# EAGLE schematic Alight_main_board_v3 (EAGLE 7.6.0)
CNAME: Alarm Light Main board / Juraj Repcik; CREVISION: 04
Assembly variants: ESP8266 CH340 default

## Sheet 1 of 3
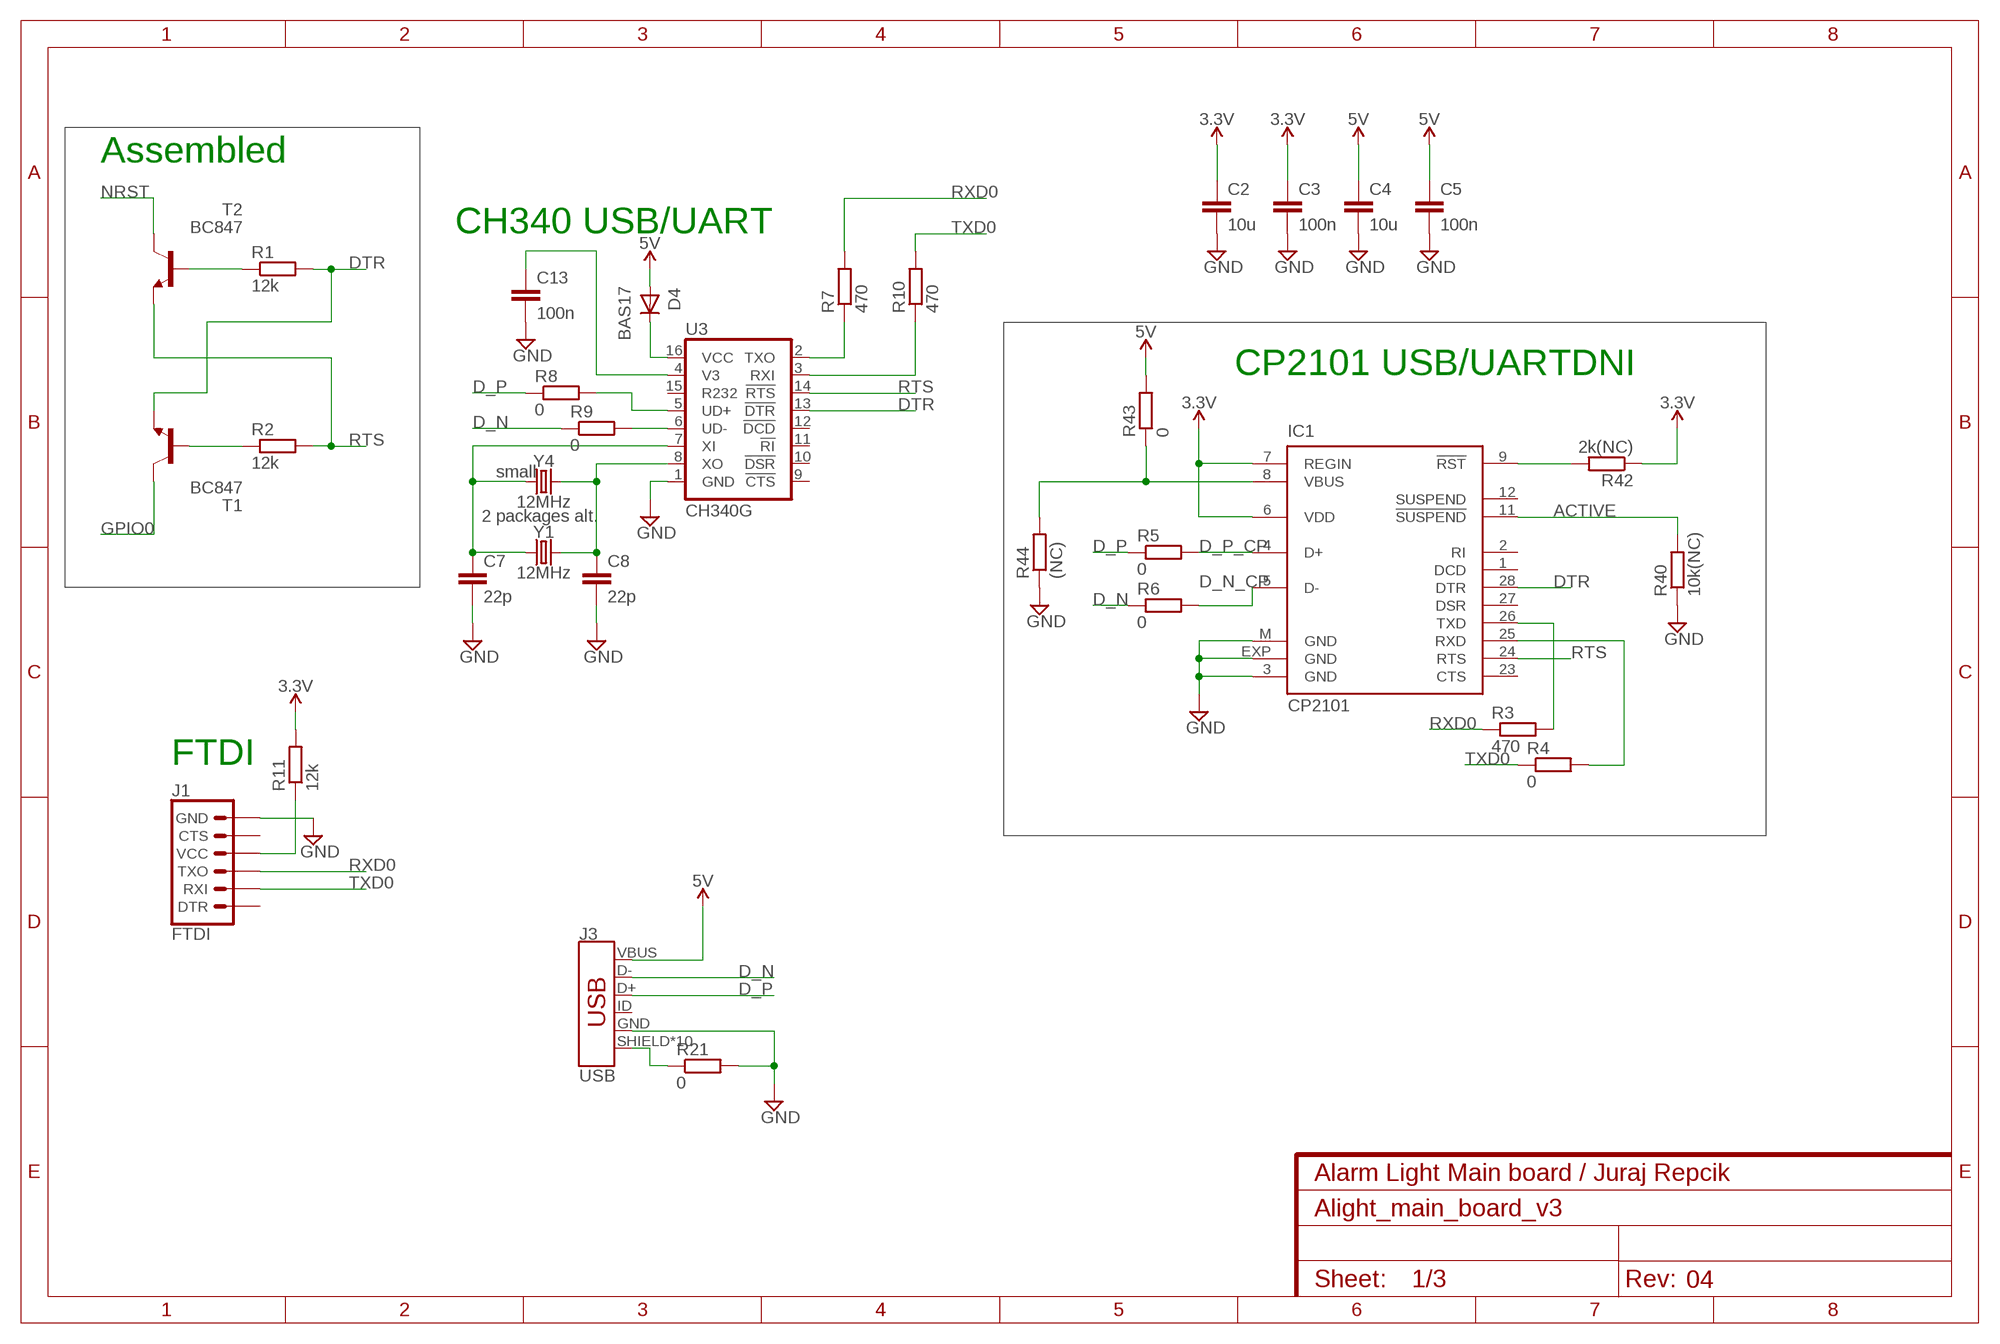
[diagram p0: schematic, sheet 1]

### Parts
C2  10u  C-EUC0603K  [C0603K]
C3  100n  C-EUC0603K  [C0603K]
C4  10u  C-EUC0603K  [C0603K]
C5  100n  C-EUC0603K  [C0603K]
C7  22p  C-EUC0402  [C0402]
C8  22p  C-EUC0402  [C0402]
C13  100n  C-EUC0603K  [C0603K]
D4  BAS17  [SOT23]
IC1  CP2101  CP210X_USB_UART  [MLP28]  (not fitted in variant ESP8266 CH340 default)
J1  FTDI  6_PIN_SERIAL_TARGETLONGPADS  [1X06_LONGPADS]
J3  USB  USB_MICRO-B_HALF_PTH_MILL  [USB-MICROB-PTH-MILL]
R1  12k  R-EU_R0603  [R0603]
R2  12k  R-EU_R0603  [R0603]
R3  470  R-EU_R0603  [R0603]  (not fitted in variant ESP8266 CH340 default)
R4  0  R-EU_R0603  [R0603]  (not fitted in variant ESP8266 CH340 default)
R5  0  R-EU_R0603  [R0603]  (not fitted in variant ESP8266 CH340 default)
R6  0  R-EU_R0603  [R0603]  (not fitted in variant ESP8266 CH340 default)
R7  470  R-EU_R0603  [R0603]
R8  0  R-EU_R0603  [R0603]
R9  0  R-EU_R0603  [R0603]
R10  470  R-EU_R0603  [R0603]
R11  12k  R-EU_R0603  [R0603]
R21  0  R-EU_R0603  [R0603]
R40  10k(NC)  R-EU_R0603  [R0603]  (not fitted in variant ESP8266 CH340 default)
R42  2k(NC)  R-EU_R0603  [R0603]  (not fitted in variant ESP8266 CH340 default)
R43  0  R-EU_R0603  [R0603]  (not fitted in variant ESP8266 CH340 default)
R44  (NC)  R-EU_R0603  [R0603]  (not fitted in variant ESP8266 CH340 default)
T1  BC847  [SOT23]
T2  BC847  [SOT23]
U3  CH340G  CH340GSMD  [SO016]
Y1  12MHz  CRYSTALSMD-HC49UP  [HC49UP]
Y4  12MHz  CRYSTAL-32.768KHZSMD-3.2X1.5  [CRYSTAL-SMD-3.2X1.5MM]  (not fitted in variant ESP8266 CH340 default)

### Nets
3.3V: C2.1 C3.1 IC1.6(VDD) IC1.7(REGIN) R11.2 R42.1 ; also sheet 2,3
5V: C4.1 C5.1 D4.1(A) J3.VBUS R43.2 ; also sheet 2,3
ACTIVE: IC1.11(!SUSPEND) R40.2
D_N: J3.D- R6.1 R9.1
D_N_CP: IC1.5(D-) R6.2
D_P: J3.D+ R5.1 R8.1
D_P_CP: IC1.4(D+) R5.2
DTR: IC1.28(DTR) R1.2 T1.2(E) U3.13(!DTR)
GND: C2.2 C3.2 C4.2 C5.2 C7.2 C8.2 C13.2 IC1.3(GND) IC1.EXP(GND) IC1.M(GND) J1.6(GND) J3.GND R21.2 R40.1 R44.1 U3.1(GND) ; also sheet 2,3
GPIO0: T1.3(C) ; also sheet 2
N$1: R1.1 T2.1(B)
N$2: R2.1 T1.1(B)
N$4: R7.1 U3.2(TXO)
N$5: R10.1 U3.3(RXI)
N$6: R8.2 U3.5(UD+)
N$7: R9.2 U3.6(UD-)
N$8: C7.1 U3.7(XI) Y1.1 Y4.P$1
N$9: C13.1 U3.4(V3)
N$10: C8.1 U3.8(XO) Y1.2 Y4.P$2
N$11: J1.4(VCC) R11.1
N$15: D4.3(K) U3.16(VCC)
N$38: IC1.9(!RST) R42.2
N$39: IC1.8(VBUS) R43.1 R44.2
NRST: T2.3(C) ; also sheet 2,3
RTS: IC1.24(RTS) R2.2 T2.2(E) U3.14(!RTS)
RXD0: J1.3(TXO) R3.1 R7.2 ; also sheet 2,3
RXD0_CP2101IN: IC1.26(TXD) R3.2
SHIELD: J3.SHIELD J3.SHIELD2(SHIELD) J3.SHIELD3(SHIELD) J3.SHIELD4(SHIELD) J3.SHIELD5(SHIELD) J3.SHIELD6(SHIELD) J3.SHIELD7(SHIELD) J3.SHIELD8(SHIELD) J3.SHIELD9(SHIELD) J3.SHIELD10(SHIELD) R21.1
TXD0: J1.2(RXI) R4.1 R10.2 ; also sheet 2,3
TXD0_CP2101: IC1.25(RXD) R4.2
Unconnected: IC1.1(DCD) IC1.2(RI) IC1.12(SUSPEND) IC1.23(CTS) IC1.27(DSR) J1.1(DTR) J1.5(CTS) J3.ID U3.9(!CTS) U3.10(!DSR) U3.11(!RI) U3.12(!DCD) U3.15(R232)

### Notes on the sheet
- Assembled
- CH340 USB/UART
- CP2101 USB/UART | DNI
- small
- 2 packages alt.
- FTDI

## Sheet 2 of 3
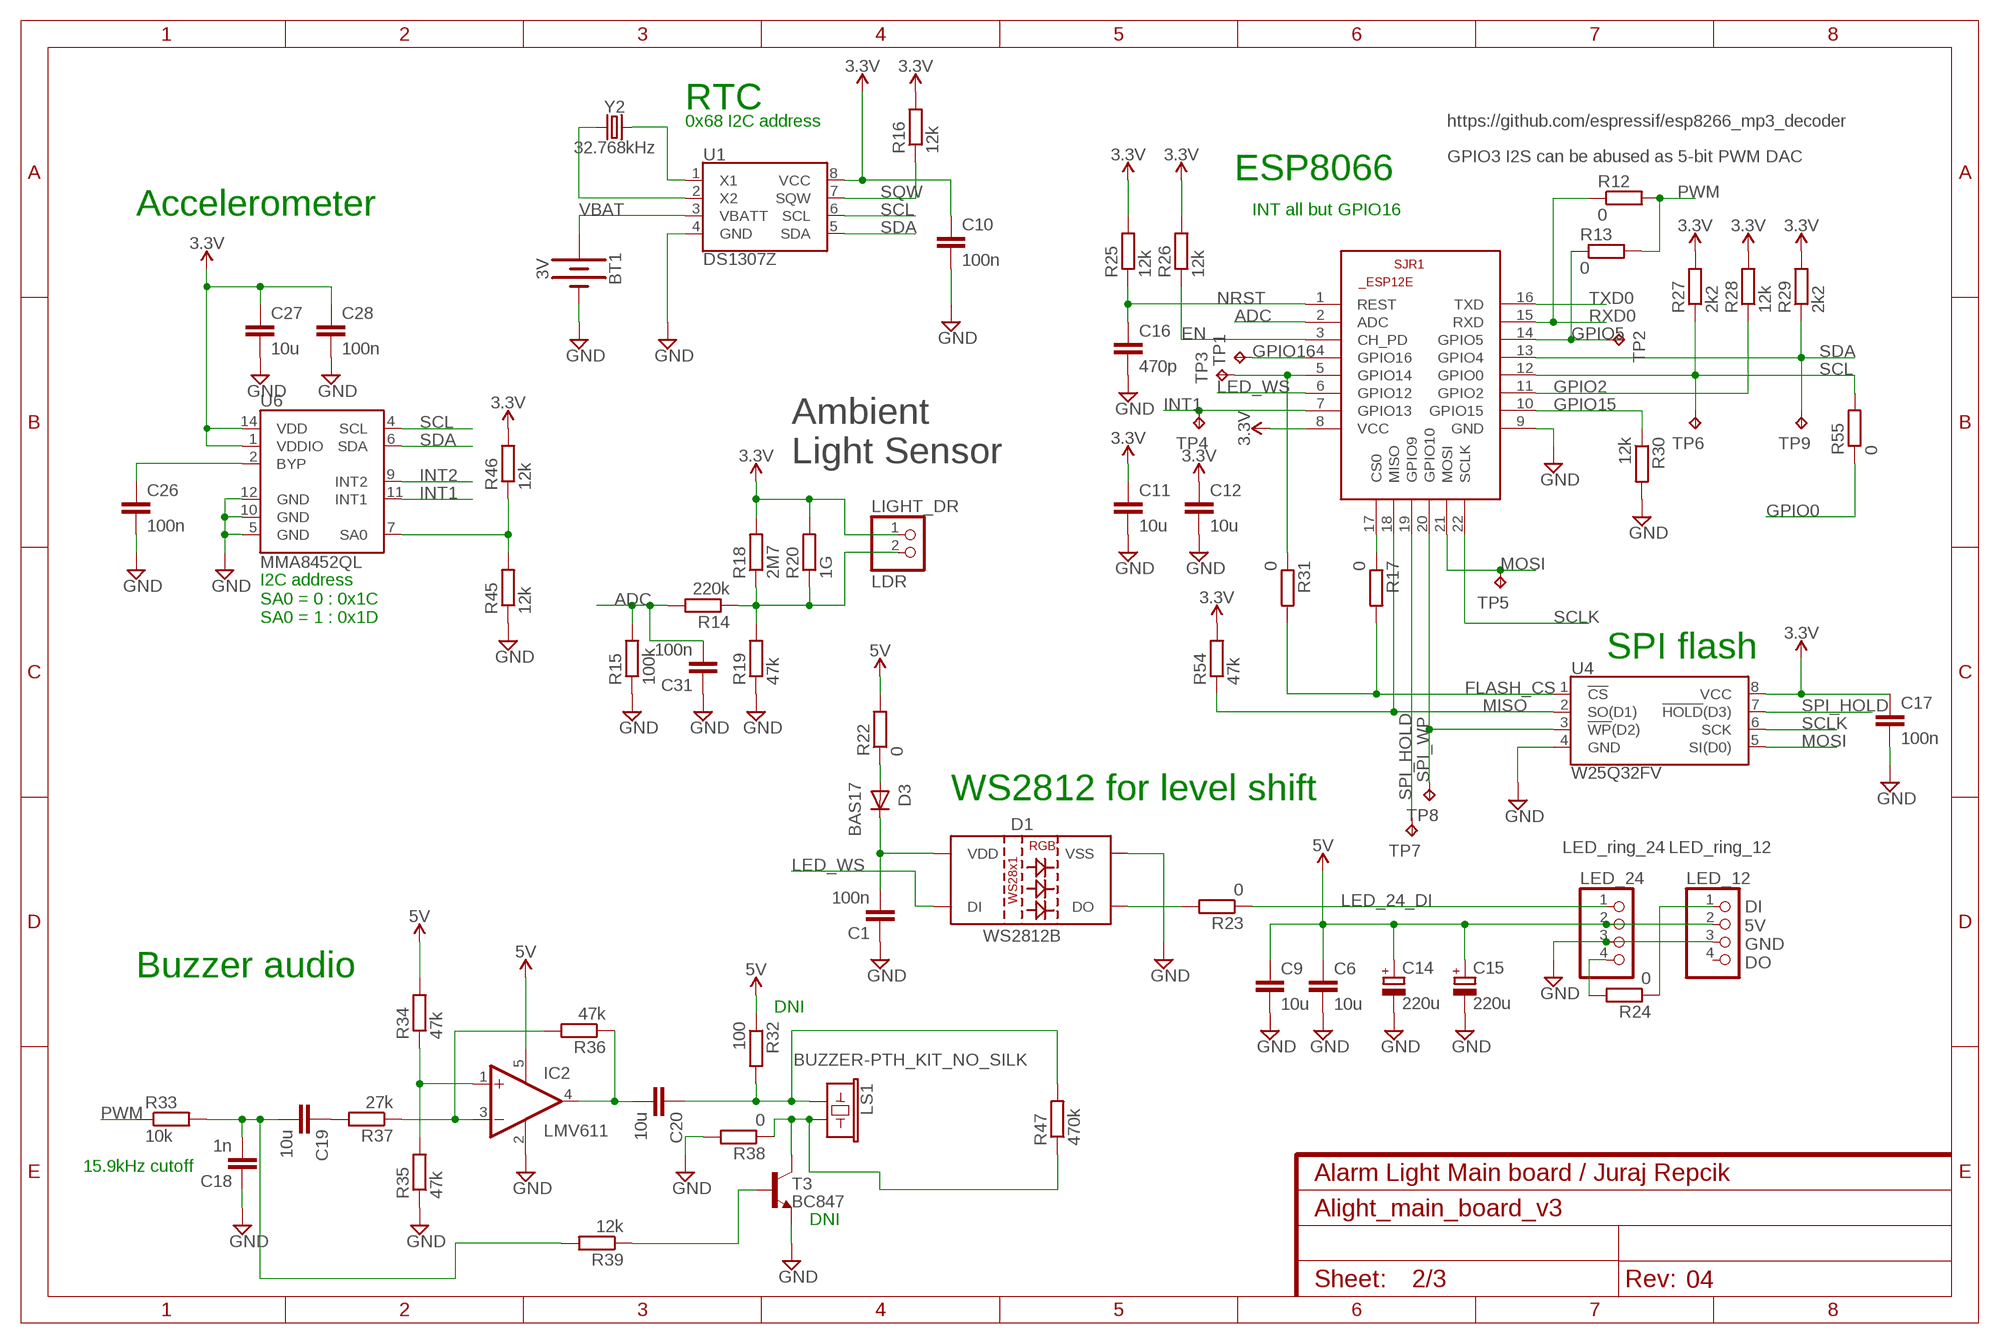
[diagram p1: schematic, sheet 2]

### Parts
BT1  3V  BATTERY-20MM_PTH_KIT  [BATTCOM_20MM_PTH_KIT]
C1  100n  C-EUC0603K  [C0603K]
C6  10u  C-EUC0603K  [C0603K]
C9  10u  C-EUC0603K  [C0603K]
C10  100n  C-EUC0603K  [C0603K]
C11  10u  C-EUC0603K  [C0603K]
C12  10u  C-EUC0603K  [C0603K]
C14  220u  CPOL-EU153CLV-0605  [153CLV-0605]
C15  220u  CPOL-EU153CLV-0605  [153CLV-0605]
C16  470p  C-EUC0603K  [C0603K]
C17  100n  C-EUC0603K  [C0603K]  (not fitted in variant ESP8266 CH340 default)
C18  1n  C-EUC0603K  [C0603K]
C19  10u  C-EUC0603K  [C0603K]
C20  10u  C-EUC0603K  [C0603K]
C26  100n  C-EUC0603K  [C0603K]
C27  10u  C-EUC0603K  [C0603K]
C28  100n  C-EUC0603K  [C0603K]
C31  100n  C-EUC0603K  [C0603K]
D1  WS2812B  [WS2812B]
D3  BAS17  [SOT23]
IC2  LMV611  OPA333DCK  [SC70-5L]
LED_12  LED_ring_12  PINHD-1X4  [1X04]
LED_24  LED_ring_24  PINHD-1X4  [1X04]
LIGHT_DR  LDR  PINHD-1X2  [1X02]
LS1  BUZZER-PTH_KIT_NO_SILK  [BUZZER-12MM-NS-KIT]
R12  0  R-EU_R0603  [R0603]
R13  0  R-EU_R0603  [R0603]  (not fitted in variant ESP8266 CH340 default)
R14  220k  R-EU_R0603  [R0603]
R15  100k  R-EU_R0603  [R0603]
R16  12k  R-EU_R0603  [R0603]
R17  0  R-EU_R0603  [R0603]  (not fitted in variant ESP8266 CH340 default)
R18  2M7  R-EU_R0603  [R0603]
R19  47k  R-EU_R0603  [R0603]
R20  1G  R-EU_R0603  [R0603]  (not fitted in variant ESP8266 CH340 default)
R22  0  R-EU_R0603  [R0603]
R23  0  R-EU_R0603  [R0603]
R24  0  R-EU_R0603  [R0603]
R25  12k  R-EU_R0603  [R0603]
R26  12k  R-EU_R0603  [R0603]
R27  2k2  R-EU_R0603  [R0603]
R28  12k  R-EU_R0603  [R0603]
R29  2k2  R-EU_R0603  [R0603]
R30  12k  R-EU_R0603  [R0603]
R31  0  R-EU_R0603  [R0603]  (not fitted in variant ESP8266 CH340 default)
R32  100  R-EU_R0603  [R0603]  (not fitted in variant ESP8266 CH340 default)
R33  10k  R-EU_R0603  [R0603]
R34  47k  R-EU_R0603  [R0603]
R35  47k  R-EU_R0603  [R0603]
R36  47k  R-EU_R0603  [R0603]
R37  27k  R-EU_R0603  [R0603]
R38  0  R-EU_R0603  [R0603]
R39  12k  R-EU_R0603  [R0603]  (not fitted in variant ESP8266 CH340 default)
R45  12k  R-EU_R0603  [R0603]  (not fitted in variant ESP8266 CH340 default)
R46  12k  R-EU_R0603  [R0603]
R47  470k  R-EU_R0603  [R0603]
R54  47k  R-EU_R0603  [R0603]  (not fitted in variant ESP8266 CH340 default)
R55  0  R-EU_R0603  [R0603]
SJR1  ESP12E/F  ESP8266-12EESP12E  [ESP8266-ESP12E]
T3  BC847  [SOT23]  (not fitted in variant ESP8266 CH340 default)
TP1  TPTP10R  [TP10R]
TP2  TPTP10R  [TP10R]
TP3  TPTP10R  [TP10R]
TP4  TPTP10R  [TP10R]
TP5  TPTP10R  [TP10R]
TP6  TPTP10R  [TP10R]
TP7  TPTP10R  [TP10R]
TP8  TPTP10R  [TP10R]
TP9  TPTP10R  [TP10R]
U1  DS1307Z  [SO08-0.15]
U4  W25Q32FV  W25Q32FVSS  [SOIC-8]  (not fitted in variant ESP8266 CH340 default)
U6  MMA8452QL  [QFN-16_0.5MM-EXTRA]
Y2  32.768kHz  CRYSTAL-32.768KHZSMD-3.2X1.5  [CRYSTAL-SMD-3.2X1.5MM]

### Nets
3.3V: C10.1 C11.1 C12.1 C17.1 C27.1 C28.1 LIGHT_DR.1 R16.2 R18.2 R20.2 R25.2 R26.2 R27.2 R28.2 R29.2 R46.2 R54.2 SJR1.8(VCC) U1.8(VCC) U4.8(VCC) U6.1(VDDIO) U6.14(VDD) ; also sheet 1,3
5V: C6.1 C9.1 C14.+ C15.+ IC2.5(V+) LED_12.2 LED_24.2 R22.2 R32.1 R34.2 ; also sheet 1,3
ADC: C31.2 R14.2 R15.2 SJR1.2(ADC) ; also sheet 3
EN: R26.1 SJR1.3(CH_PD)
FLASH_CS: R17.2 R31.2 U4.1(!CS!) ; also sheet 3
GND: BT1.2(-) C1.1 C6.2 C9.2 C10.2 C11.2 C12.2 C14.- C15.- C16.2 C17.2 C18.1 C26.2 C27.2 C28.2 C31.1 D1.3(VSS) IC2.2(V-) LED_12.3 LED_24.3 R15.1 R19.1 R30.2 R35.1 R38.2 R45.1 SJR1.9(GND) T3.2(E) U1.4(GND) U4.4(GND) U6.5(GND) U6.10(GND) U6.12(GND) ; also sheet 1,3
GPIO0: R55.1 ; also sheet 1
GPIO2: R28.1 SJR1.11(GPIO2) ; also sheet 3
GPIO5: R13.1 SJR1.14(GPIO5) TP2.TP
GPIO15: R30.1 SJR1.10(GPIO15)
GPIO16: SJR1.4(GPIO16) TP1.TP
INT1: SJR1.7(GPIO13) TP4.TP U6.11(INT1) ; also sheet 3
INT2: U6.9(INT2) ; also sheet 3
LED_12DI: LED_12.1 R24.1
LED_24_DI: LED_24.1 R23.1
LED_24_DO: LED_24.4 R24.2
LED_WS: D1.4(DI) SJR1.6(GPIO12) ; also sheet 3
MISO: R54.1 SJR1.18(MISO) U4.2(SO(D1))
MOSI: SJR1.21(MOSI) TP5.TP U4.5(SI(D0))
N$3: C1.2 D1.1(VDD) D3.3(K)
N$14: LIGHT_DR.2 R14.1 R18.1 R19.2 R20.1
N$16: D3.1(A) R22.1
N$18: D1.2(DO) R23.2
N$19: C26.1 U6.2(BYP)
N$21: R31.1 SJR1.5(GPIO14) TP3.TP
N$22: R17.1 SJR1.17(CS0)
N$25: LS1.- R38.1 R47.1 T3.3(C)
N$26: R39.1 T3.1(B)
N$28: IC2.1(+IN) R34.1 R35.2
N$30: U1.1(X1) Y2.P$2
N$31: U1.2(X2) Y2.P$1
N$32: IC2.3(-IN) R36.2 R37.1
N$33: C20.1 LS1.+ R32.2 R47.2
N$34: C19.1 R37.2
N$35: C20.2 IC2.4(OUT) R36.1
N$36: C18.2 C19.2 R33.2 R39.2
N$40: R45.2 R46.1 U6.7(SA0)
NRST: C16.1 R25.1 SJR1.1(REST) ; also sheet 1,3
PWM: R12.2 R13.2 R33.1 ; also sheet 3
RXD0: R12.1 SJR1.15(RXD) ; also sheet 1,3
SCL: R27.1 R55.2 SJR1.12(GPIO0) TP6.TP U1.6(SCL) U6.4(SCL) ; also sheet 3
SCLK: SJR1.22(SCLK) U4.6(SCK)
SDA: R29.1 SJR1.13(GPIO4) TP9.TP U1.5(SDA) U6.6(SDA) ; also sheet 3
SPI_HOLD: SJR1.19(GPIO9) TP7.TP U4.7(!HOLD!(D3))
SPI_WP: SJR1.20(GPIO10) TP8.TP U4.3(!WP!(D2))
SQW: R16.1 U1.7(SQW)
TXD0: SJR1.16(TXD) ; also sheet 1,3
VBAT: BT1.1(+) U1.3(VBATT)
Unconnected: LED_12.4

### Notes on the sheet
- RTC
- 0x68 I2C address | https://github.com/espressif/esp8266_mp3_decoder
- GPIO3 I2S can be abused as 5-bit PWM DAC
- ESP8066
- Accelerometer | INT all but GPIO16
- Ambient
  Light Sensor
- I2C address
  SA0 = 0 : 0x1C
  SA0 = 1 : 0x1D
- SPI flash
- WS2812 for level shift
- DI
  5V
  GND
  DO
- Buzzer audio
- DNI
- 15.9kHz cutoff
- DNI

## Sheet 3 of 3
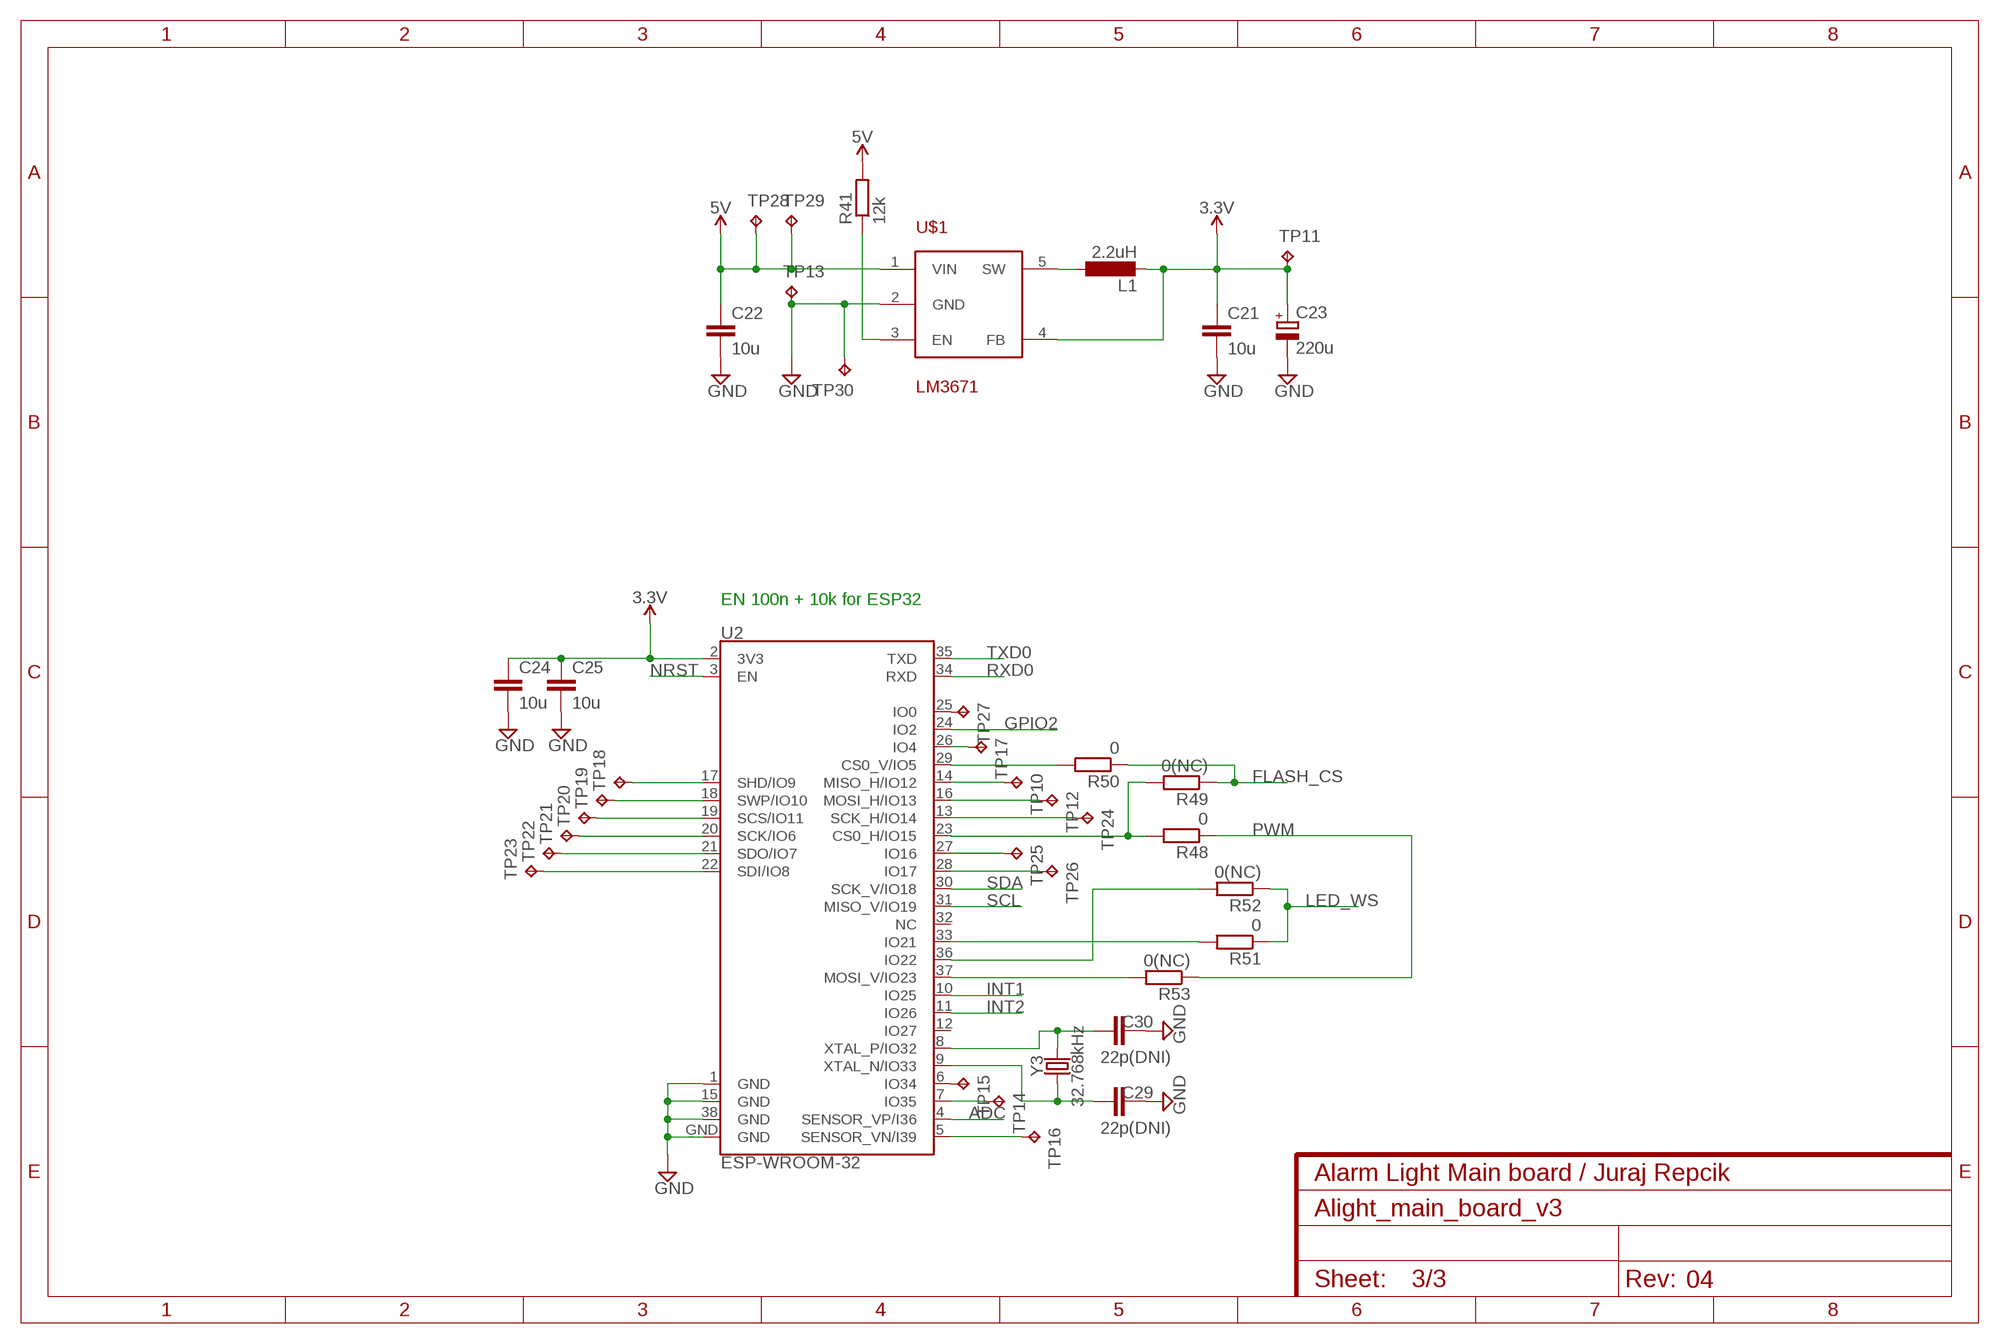
[diagram p2: schematic, sheet 3]

### Parts
C21  10u  C-EUC0603K  [C0603K]
C22  10u  C-EUC0603K  [C0603K]
C23  220u  CPOL-EU153CLV-0605  [153CLV-0605]
C24  10u  C-EUC0603K  [C0603K]  (not fitted in variant ESP8266 CH340 default)
C25  10u  C-EUC0603K  [C0603K]  (not fitted in variant ESP8266 CH340 default)
C29  22p(DNI)  C-EUC0402  [C0402]  (not fitted in variant ESP8266 CH340 default)
C30  22p(DNI)  C-EUC0402  [C0402]  (not fitted in variant ESP8266 CH340 default)
L1  2.2uH  L-EUL3225M  [L3225M]
R41  12k  R-EU_R0603  [R0603]
R48  0  R-EU_R0603  [R0603]  (not fitted in variant ESP8266 CH340 default)
R49  0(NC)  R-EU_R0603  [R0603]  (not fitted in variant ESP8266 CH340 default)
R50  0  R-EU_R0603  [R0603]  (not fitted in variant ESP8266 CH340 default)
R51  0  R-EU_R0603  [R0603]  (not fitted in variant ESP8266 CH340 default)
R52  0(NC)  R-EU_R0603  [R0603]  (not fitted in variant ESP8266 CH340 default)
R53  0(NC)  R-EU_R0603  [R0603]  (not fitted in variant ESP8266 CH340 default)
TP10  TPTP10R  [TP10R]
TP11  TPTP10R  [TP10R]
TP12  TPTP10R  [TP10R]
TP13  TPTP10R  [TP10R]
TP14  TPTP10R  [TP10R]
TP15  TPTP10R  [TP10R]
TP16  TPTP10R  [TP10R]
TP17  TPTP10R  [TP10R]
TP18  TPTP10R  [TP10R]
TP19  TPTP10R  [TP10R]
TP20  TPTP10R  [TP10R]
TP21  TPTP10R  [TP10R]
TP22  TPTP10R  [TP10R]
TP23  TPTP10R  [TP10R]
TP24  TPTP10R  [TP10R]
TP25  TPTP10R  [TP10R]
TP26  TPTP10R  [TP10R]
TP27  TPTP10R  [TP10R]
TP28  TPTP10R  [TP10R]
TP29  TPTP10R  [TP10R]
TP30  TPTP10R  [TP10R]
U2  ESP-WROOM-32  [ESP-WROOM-32]  (not fitted in variant ESP8266 CH340 default)
U$1  LM3671  [SOT23-5]
Y3  32.768kHz  CRYSTAL-32.768KHZSMD-3.2X1.5  [CRYSTAL-SMD-3.2X1.5MM]  (not fitted in variant ESP8266 CH340 default)

### Nets
3.3V: C21.1 C23.+ C24.1 C25.1 L1.2 TP11.TP U2.2(3V3) U$1.4(FB) ; also sheet 1,2
5V: C22.1 R41.2 TP28.TP TP29.TP U$1.1(VIN) ; also sheet 1,2
ADC: U2.4(SENSOR_VP/I36) ; also sheet 2
FLASH_CS: R49.1 R50.1 ; also sheet 2
GND: C21.2 C22.2 C23.- C24.2 C25.2 C29.2 C30.2 TP13.TP TP30.TP U2.1(GND) U2.15(GND) U2.38(GND) U2.GND U$1.2(GND) ; also sheet 1,2
GPIO2: U2.24(IO2) ; also sheet 2
INT1: U2.10(IO25) ; also sheet 2
INT2: U2.11(IO26) ; also sheet 2
LED_WS: R51.1 R52.1 ; also sheet 2
N$12: C30.1 U2.8(XTAL_P/IO32) Y3.P$2
N$13: C29.1 U2.9(XTAL_N/IO33) Y3.P$1
N$20: R48.2 R49.2 U2.23(CS0_H/IO15)
N$23: R51.2 U2.33(IO21)
N$24: R52.2 U2.36(IO22)
N$27: R41.1 U$1.3(EN)
N$37: L1.1 U$1.5(SW)
N$41: R50.2 U2.29(CS0_V/IO5)
N$42: R53.2 U2.37(MOSI_V/IO23)
N$43: TP14.TP U2.7(IO35)
N$44: TP15.TP U2.6(IO34)
N$45: TP16.TP U2.5(SENSOR_VN/I39)
N$46: TP17.TP U2.26(IO4)
N$47: TP18.TP U2.17(SHD/IO9)
N$48: TP19.TP U2.18(SWP/IO10)
N$49: TP20.TP U2.19(SCS/IO11)
N$50: TP21.TP U2.20(SCK/IO6)
N$51: TP22.TP U2.21(SDO/IO7)
N$52: TP23.TP U2.22(SDI/IO8)
N$63: TP10.TP U2.14(MISO_H/IO12)
N$64: TP12.TP U2.16(MOSI_H/IO13)
N$65: TP24.TP U2.13(SCK_H/IO14)
N$66: TP25.TP U2.27(IO16)
N$67: TP26.TP U2.28(IO17)
N$68: TP27.TP U2.25(IO0)
NRST: U2.3(EN) ; also sheet 1,2
PWM: R48.1 R53.1 ; also sheet 2
RXD0: U2.34(RXD) ; also sheet 1,2
SCL: U2.31(MISO_V/IO19) ; also sheet 2
SDA: U2.30(SCK_V/IO18) ; also sheet 2
TXD0: U2.35(TXD) ; also sheet 1,2
Unconnected: U2.12(IO27) U2.32(NC)

### Notes on the sheet
- EN 100n + 10k for ESP32

## Library data of the parts
BT1 = SparkFun-Batteries:BATTERY: Battery - Single Cell A variety of battery chemistries, sizes, and footprints. Device List: 20MM_PTH - Coin Cell Battery Holder - 20mm (PTH) <https://www.sparkfun.com/products/783> 20MM_PTH_KIT- Coin Cell battery Holder - 20 mm (PTH) <http://www.sparkfun.com/products/783>kit version with special mask 6.8MM_PTH - Coin Cell Battery Holder - 6.8MM(SMD) <https://www.digikey.com/product-detail/en/seiko-instruments/MS621FE-FL11E/728-1057-ND/1889208?WT.srch=1&gclid=CNOQ5a6LzdQCFZS2wAodXCkE0g> 12MM_SMD - Coin Cell Battery Holder - 12mm (SMD) <https://www.sparkfun.com/products/10592> 12MM_PTH - Coin Cell Battery Holder - 12mm (PTH) <https://www.sparkfun.com/products/7948> 20MM_SMD - 20mm Coin Cell Battery Holder (SMD) (2 legs) Used on the Big Time Watch Kit <https://www.sparkfun.com/products/11734> 20MM_SMD_4LEGS - Coin Cell Battery Holder - 20mm (SMD) <https://www.sparkfun.com/products/11892> 20MM_SMD_4LEGS_OVERPASTE - Coin Cell Battery Holder - 20mm (SMD) <https://www.sparkfun.com/products/11892> (Over-paste on the legs) 24.5MM_PTH - Coin Cell Battery Holder - 24.5mm (PTH) <https://www.sparkfun.com/products/8863> 9V - 9V Battery Holder - PC Mount Used on the SparkFun SparkPunk Sound Kit <https://www.sparkfun.com/products/11177> and SparkFun SparkPunk Sequencer Kit <https://www.sparkfun.com/products/12707> 18650 - Battery Holder - 18650 (PTH) <https://www.sparkfun.com/products/13113> AA - Battery Holder - 1xAA (PTH) <https://www.sparkfun.com/products/7949> AAA - Battery Holder - 1xAAA (PTH) <https://www.sparkfun.com/products/12718> AA_KIT - Battery Holder - 1xAA (PTH) <https://www.sparkfun.com/products/7949> Special kit package - pads only have exposed copper on one side of the board. AAA_KIT - Battery Holder - 1xAAA (PTH) <https://www.sparkfun.com/products/12718> Special kit package - pads only have exposed copper on one side of the board.
C1-C13 C16-C22 C24-C31 = resistor:C-EU: CAPACITOR, European symbol
C14 C15 C23 = resistor:CPOL-EU: POLARIZED CAPACITOR, European symbol
D1 = SparkFun-LED:WS2812B: WS2812B SMD addressable RGB LED 5x5mm SMD LED with built-in controller IC. Color: Red/Green/Blue mC Rating: RGB: 390, 660, 180 mcd Forward Voltage: RGB: 2.0, 3.0, 3.0 V Packages:WS2812B SparkFun Products: Blynk Board - ESP8266 <https://www.sparkfun.com/products/13794>; PROD_ID: DIO-12503
D3 D4 = nxp_60:BAS17: Low-voltage stabistor Low-voltage stabilization diode in a small SOT23 plastic package. AAL Eindhoven MK
IC1 = SparkFun-Retired:CP210X_USB_UART: Single-Chip USB to UART Bridge Source: www.silabs.com .. CP2101.pdf / cp2102.pdf. Spark Fun Electronics SKU : COM-00310 RETIRED: IC-00865; PROD_ID: COM-00310
IC2 = linear:OPA333: 1.8V, microPOWER CMOS OPERATIONAL AMPLIFIERS Zerø-Drift Series Source: Texas Instruments (Burr-Brown) .. U11 opa333 Operational Amp.pdf
J1 = SparkFun-Connectors:6_PIN_SERIAL_TARGET: 6-pin header connection for use with the "FTDI BASIC" pinout - TARGET SIDE. Also known as "Arduino Serial Program Header". It is used to mate with our FTDI Basic serial programmers using the Arduino IDE. Note, this device has "TARGET" in the name. It is intended to be used on a design that contains a target micro-controller that you wish to program. The "sister" device, named "CABLE" is inteneded to be used on a design that usually lives on the end of your USB cable and prvides the converter chip (FTDI232 or FTDI231x) to commnicate serial RX/TX. You can populate with some of these: Break Away Headers - Straight <https://www.sparkfun.com/products/116> (PRT-00116) For reference (or to suit your programming needs) check out these designs: SparkFun FTDI Basic Breakout - 5V <https://www.sparkfun.com/products/9716> (DEV-09716) SparkFun FTDI Basic Breakout - 3.3V <https://www.sparkfun.com/products/9873> (DEV-09873) SparkFun FTDI SmartBasic <https://www.sparkfun.com/products/12935> (DEV-12935) SparkFun Beefy 3 - FTDI Basic Breakout <https://www.sparkfun.com/products/13746> (DEV-13746)
J3 = SparkFun-Connectors:USB_MICRO-B: USB Type Micro-B Connector Male/female and PTH/SMT variants SparkFun Products: SparkFun microB USB Breakout <https://www.sparkfun.com/products/12035> SparkFun USB microB Plug Breakout <https://www.sparkfun.com/products/10031> SparkFun ESP8266 Thing <https://www.sparkfun.com/products/13231>; PROD_ID: CONN-13711
L1 = resistor:L-EU: INDUCTOR, European symbol
LED_12 LED_24 = pinhead:PINHD-1X4: PIN HEADER
LIGHT_DR = pinhead:PINHD-1X2: PIN HEADER
LS1 = SparkFun-Electromechanical:BUZZER: Buzzer Small round buzzers that operate around the audible 2kHz range. You can use these as speakers to create simple music or user interfaces. Variant Overview: PTH - Mini Speaker - PC Mount 12mm 2.048kHz <https://www.sparkfun.com/products/7950> PTH_KIT - Mini Speaker - PC Mount 12mm 2.048kHz <https://www.sparkfun.com/products/7950> KIT simplifies soldering by adding stop mask to one side of the pads. PTH_NO_SILK - Mini Speaker - PC Mount 12mm 2.048kHz <https://www.sparkfun.com/products/7950> No silkscreen indicator of buzzer outline. PTH_KIT_NO_SILK - Mini Speaker - PC Mount 12mm 2.048kHz <https://www.sparkfun.com/products/7950> KIT package w/o silkscreen SMD - Buzzer Audio Magnetic (CCV-084B16) SMD buzzer used on, e.g. the LilyPad Buzzer <https://www.sparkfun.com/products/8463> and RFID USB Reader <https://www.sparkfun.com/products/9963>. SMD_KIT - Buzzer Audio Magnetic (CCV-084B16) SMD Buzzer with elongated pins to make soldering easier. Used on the SparkFun Simon Says - Surface Mount Soldering Kit <https://www.sparkfun.com/products/10935>.; PROD_ID: COMP-08253; SF_SKU: COM-07950
R1-R55 = resistor:R-EU_: RESISTOR, European symbol
SJR1 = esp12e:ESP8266-12E: ESP8266-12E Library for Eagle CAD The author not responsible for any damages or errors!. Created by Suhail jr.lt;/author>
T1 T2 = transistor-neu-to92:BC847: NPN TRANSISTOR
T3 = nxp_60:BC847: 45 V, 100 mA NPN general-purpose transistors NPN general-purpose transistor AAL Eindhoven MK
TP1-TP30 = testpad:TP: Test pad
U1 = SparkFun-Clocks:DS1307: Maxim DS1307 - I2C Real-time clock (RTC) The DS1307 serial real-time clock (RTC) is a low-power, full binary-coded decimal (BCD) clock/calendar plus 56 bytes of NV SRAM. Address and data are transferred serially through an I2C, bidirectional bus. The clock/calendar provides seconds, minutes, hours, day, date, month, and year information. SparkFun Products: Real Time Clock Module <https://www.sparkfun.com/products/12708> (BOB-12708) Datasheet <https://cdn.sparkfun.com/datasheets/BreakoutBoards/DS1307.pdf>; PROD_ID: IC-08138
U2 = SparkFun-RF:ESP-WROOM-32; PROD_ID: IC-13849
U3 = SparkFun-IC-Comms:CH340G: A simple USB 2.0 to Serial IC.; PROD_ID: IC-13498
U4 = SparkFun-IC-Memory:W25Q32FV: W25Q32FV 32Mb (4MB) Serial Flash Memory The W25Q32FV support the standard Serial Peripheral Interface (SPI), Dual/Quad I/O SPI as well as 2-clocks instruction cycle Quad Peripheral Interface (QPI). 104MHz, SPI, 8-SOIC-EIAJ Datasheet <http://www.winbond.com/resource-files/w25q32fv%20revh%20091613.pdf> SparkFun Products SparkFun Blynk Board - ESP8266 <https://www.sparkfun.com/products/13794> (WRL-13794); PROD_ID: IC-13229
U6 = MMA8452Q:MMA8452Q: MMA8452Q 3-Axis, 12/8-bit Digital Accelerometer Supply Voltage: 1.6-3.6V Range: +/- 2g, 4g, 8g Interface: I2C, 12-bit and 8-bit ODR: 1.56 Hz - 800 Hz Package: QFN-16 http://cache.freescale.com/files/sensors/doc/data_sheet/MMA8452Q.pdf; AVAILABILITY: Unavailable; DESCRIPTION: Sensor: accelerometer; Range: 2/4/8g; -40÷85°C; 1.95÷3.6V; MF: NXP Semiconductors; MP: MMA8452Q; PACKAGE: None; PRICE: None
U$1 = texas-custom:LM3671: Texas Instruments LM3671, LM3671Q 2MHz, 600mA Step-Down DC-DC Converter
Y1 = SparkFun-Clocks:CRYSTAL: Crystals (Generic) These are passive quartz crystals, which can be used as a clock source for a microcontroller. Crystal's are two-terminal devices. They require external "load" capacitors to generate an oscillating signal.
Y2 Y3 = SparkFun-Clocks:CRYSTAL-32.768KHZ: 32.768kHz Crystal Frequency: 32.768kHz Frequency Stability: ±20ppm Load Capacitance: 12.5pF (PTH-2X6 & SMD-3.2X1.5), 6pF (SMD-2X6) SparkFun Products: SparkFun BigTime Watch Kit <https://www.sparkfun.com/products/11734> SparkFun nRF52832 Breakout <https://www.sparkfun.com/products/13990> SparkFun Real Time Clock Module <https://www.sparkfun.com/products/12708>; PROD_ID: XTAL-13062
Y4 = SparkFun-Clocks:CRYSTAL-32.768KHZ: 32.768kHz Crystal Frequency: 32.768kHz Frequency Stability: ±20ppm Load Capacitance: 12.5pF (PTH-2X6 & SMD-3.2X1.5), 6pF (SMD-2X6) SparkFun Products: SparkFun BigTime Watch Kit <https://www.sparkfun.com/products/11734> SparkFun nRF52832 Breakout <https://www.sparkfun.com/products/13990> SparkFun Real Time Clock Module <https://www.sparkfun.com/products/12708>; PROD_ID: XTAL-13062; VALUE: 32.768kHz